# Altium project RF-lxSpark_1v0.PrjPcb (part 3 of 3)

## Sheet 15_BoardPowerSupply.SchDoc: Board power supply
size A3; Organization: Lime Microsystems; Address1: Surrey Tech Centre; Address2: Guildford GU2 7YG; Address3: Surrey; Address4: United Kingdom; Revision: SoDeRa-PCI v1.0; SheetNumber: 13; SheetTotal: 13
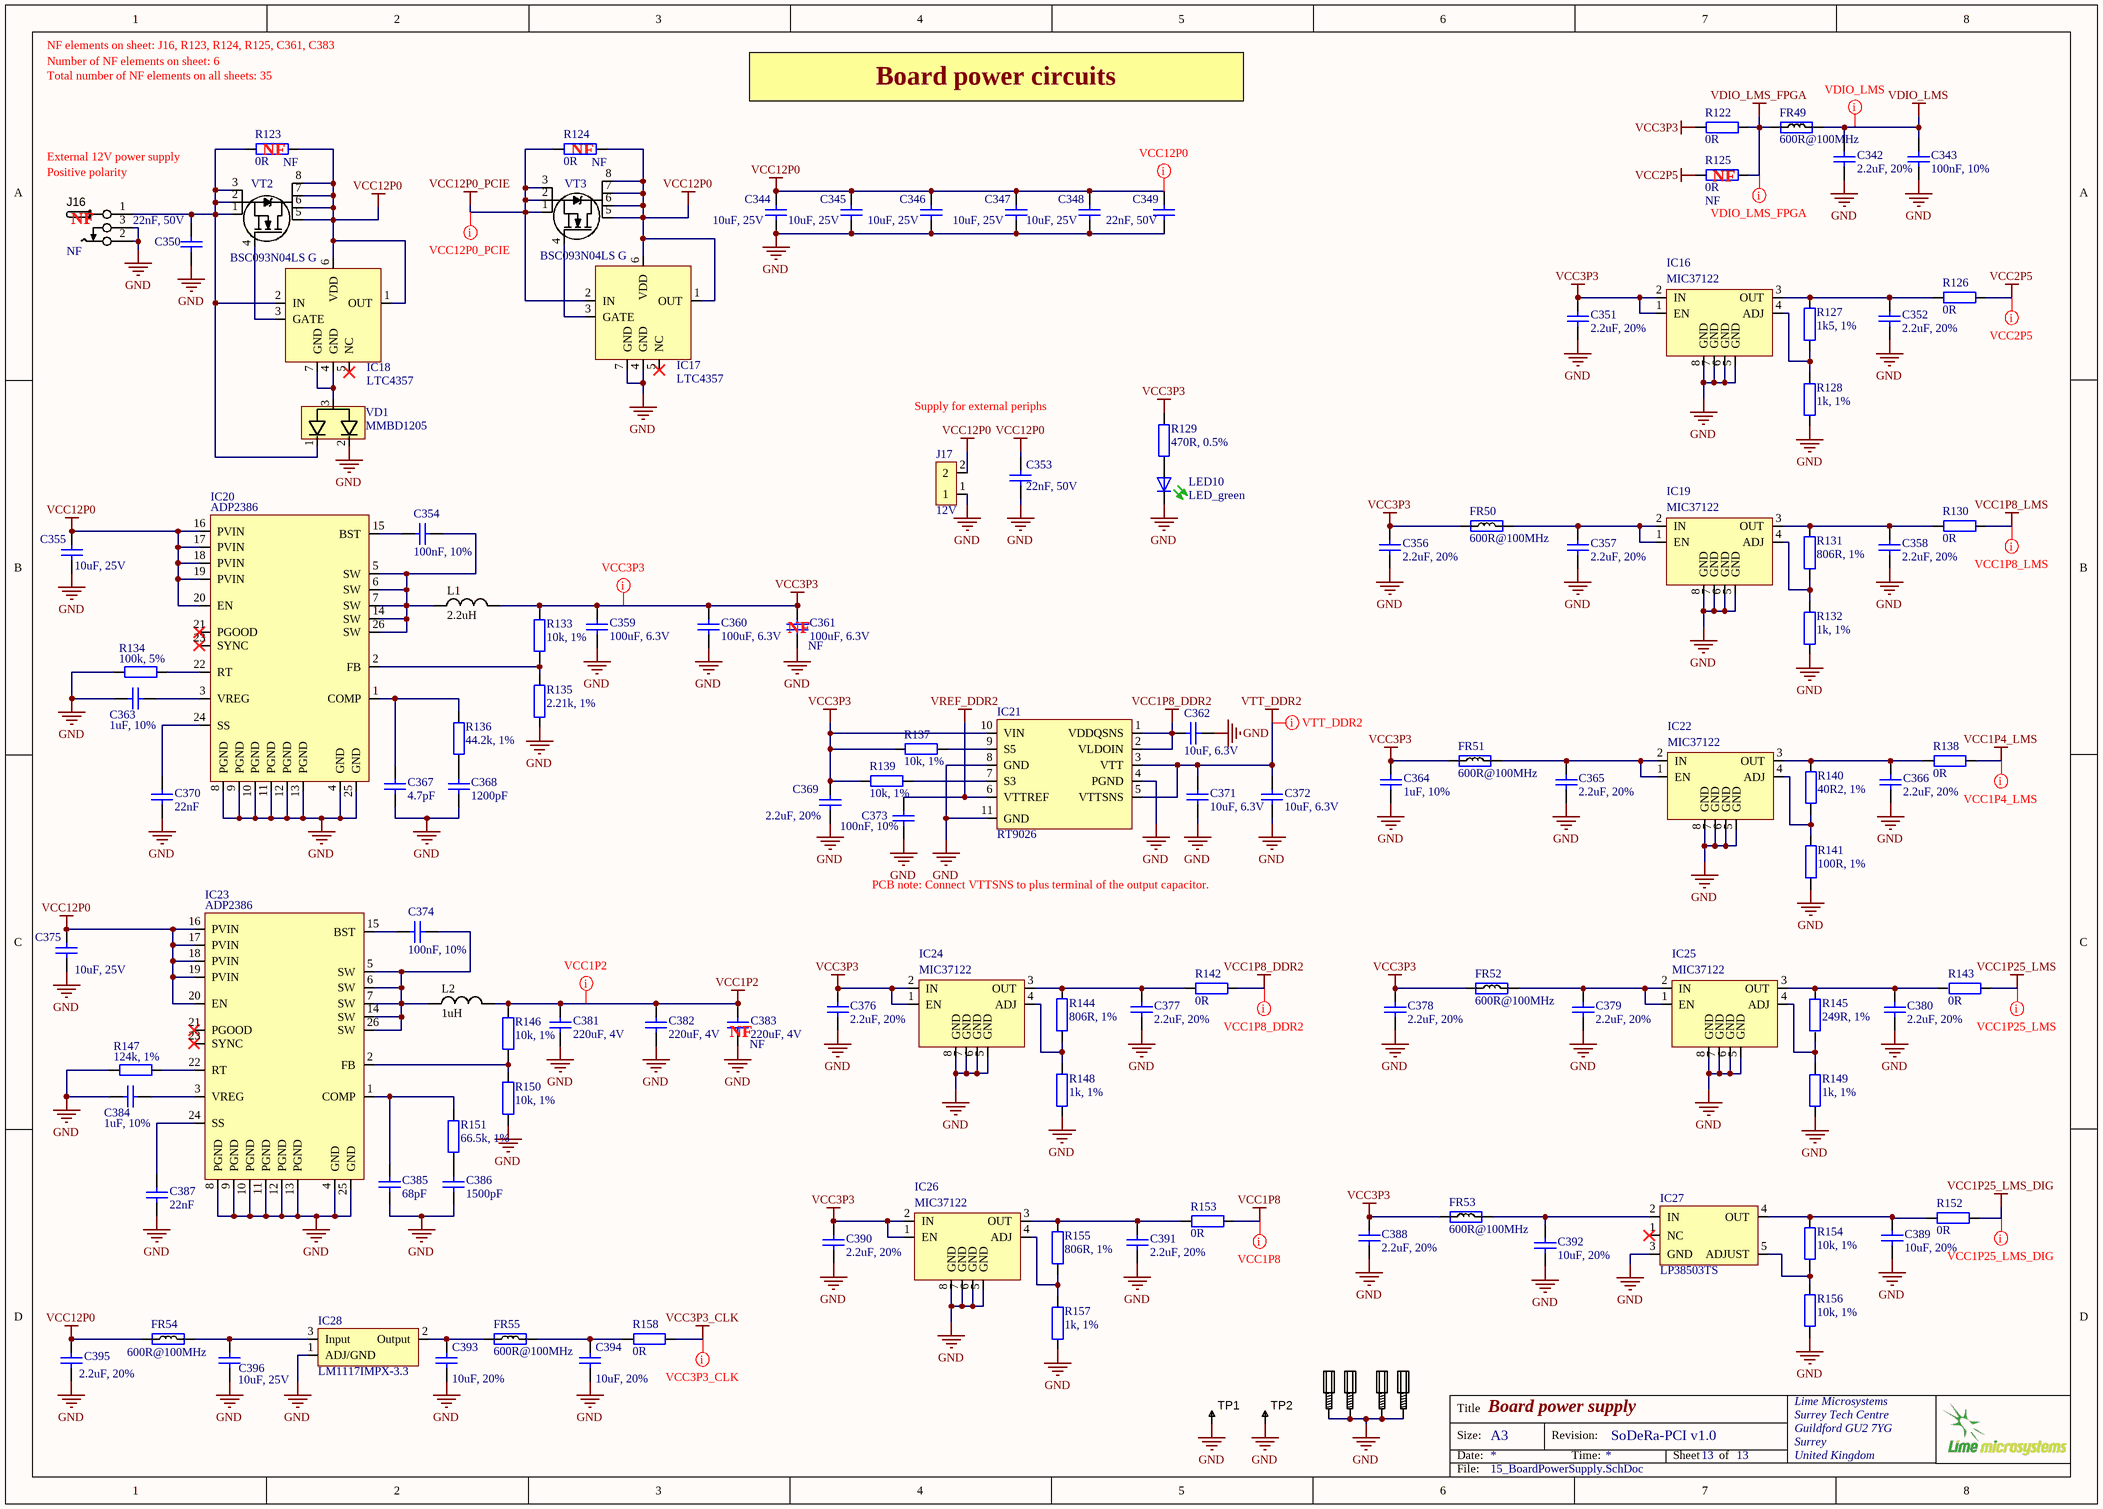
[diagram p8: 15_BoardPowerSupply.SchDoc]

### Parts
C342  2.2uF, 20%  [CAP0402]
C343  100nF, 10%  [CAP0402]
C344  10uF, 25V  [CAP0603]
C345  10uF, 25V  [CAP0603]
C346  10uF, 25V  [CAP0603]
C347  10uF, 25V  [CAP0603]
C348  10uF, 25V  [CAP0603]
C349  22nF, 50V  [CAP0402]
C350  22nF, 50V  [CAP0402]
C351  2.2uF, 20%  [CAP0402]
C352  2.2uF, 20%  [CAP0402]
C353  22nF, 50V  [CAP0402]
C354  100nF, 10%  [CAP0402]
C355  10uF, 25V  [CAP0603]
C356  2.2uF, 20%  [CAP0402]
C357  2.2uF, 20%  [CAP0402]
C358  2.2uF, 20%  [CAP0402]
C359  100uF, 6.3V  [CAP1206]
C360  100uF, 6.3V  [CAP1206]
C361  100uF, 6.3V  Assembly Info: NF  [CAP1206]
C362  10uF, 6.3V  [CAP0603]
C363  1uF, 10%  [CAP0402]
C364  1uF, 10%  [CAP0402]
C365  2.2uF, 20%  [CAP0402]
C366  2.2uF, 20%  [CAP0402]
C367  4.7pF  [CAP0402]
C368  1200pF  [CAP0402]
C369  2.2uF, 20%  [CAP0402]
C370  22nF  [CAP0402]
C371  10uF, 6.3V  [CAP0603]
C372  10uF, 6.3V  [CAP0603]
C373  100nF, 10%  [CAP0402]
C374  100nF, 10%  [CAP0402]
C375  10uF, 25V  [CAP0603]
C376  2.2uF, 20%  [CAP0402]
C377  2.2uF, 20%  [CAP0402]
C378  2.2uF, 20%  [CAP0402]
C379  2.2uF, 20%  [CAP0402]
C380  2.2uF, 20%  [CAP0402]
C381  220uF, 4V  [CAP1206]
C382  220uF, 4V  [CAP1206]
C383  220uF, 4V  Assembly Info: NF  [CAP1206]
C384  1uF, 10%  [CAP0402]
C385  68pF  [CAP0402]
C386  1500pF  [CAP0402]
C387  22nF  [CAP0402]
C388  2.2uF, 20%  [CAP0402]
C389  10uF, 20%  [CAP0603]
C390  2.2uF, 20%  [CAP0402]
C391  2.2uF, 20%  [CAP0402]
C392  10uF, 20%  [CAP0603]
C393  10uF, 20%  [CAP0603]
C394  10uF, 20%  [CAP0603]
C395  2.2uF, 20%  [CAP0402]
C396  10uF, 25V  [CAP0603]
FR49  600R@100MHz  [RES0805]
FR50  600R@100MHz  [RES0805]
FR51  600R@100MHz  [RES0805]
FR52  600R@100MHz  [RES0805]
FR53  600R@100MHz  [RES0805]
FR54  600R@100MHz  [RES0805]
FR55  600R@100MHz  [RES0805]
IC16  MIC37122  [MIC37122YM TR_SO8]
IC17  LTC4357  [LTC4357]
IC18  LTC4357  [LTC4357]
IC19  MIC37122  [MIC37122YM TR_SO8]
IC20  ADP2386  [ADP2386]
IC21  RT9026  [MSOP10]
IC22  MIC37122  [MIC37122YM TR_SO8]
IC23  ADP2386  [ADP2386]
IC24  MIC37122  [MIC37122YM TR_SO8]
IC25  MIC37122  [MIC37122YM TR_SO8]
IC26  MIC37122  [MIC37122YM TR_SO8]
IC27  LP38503TS  [TO-263-5_v2]
IC28  LM1117IMPX-3.3  [sot223]
J16  Assembly Info: NF  [CONN_PWR_JACK_v2]  (hidden comment: CONN_PWR_JACK_2.1x5.5mm)
J17  12V  [HDR_1x2]
L1  2.2uH  [FDVE1040_TOKO_INDUCTOR]
L2  1uH  [FDVE1040_TOKO_INDUCTOR]
LED10  LED_green  [LED-0603-GREEN]
MECH1  # pcs.  [PCB_standoff]  (value not drawn)
MECH2  # pcs.  [PCB_standoff]  (value not drawn)
MECH3  # pcs.  [PCB_standoff]  (value not drawn)
MECH4  # pcs.  [PCB_standoff]  (value not drawn)
R122  0R  [RES0402]
R123  0R  Assembly Info: NF  [RES0805]
R124  0R  Assembly Info: NF  [RES0805]
R125  0R  Assembly Info: NF  [RES0402]
R126  0R  [RES0402]
R127  1k5, 1%  [RES0402]
R128  1k, 1%  [RES0402]
R129  470R, 0.5%  [RES0402]
R130  0R  [RES0402]
R131  806R, 1%  [RES0402]
R132  1k, 1%  [RES0402]
R133  10k, 1%  [RES0402]
R134  100k, 5%  [RES0402]
R135  2.21k, 1%  [RES0402]
R136  44.2k, 1%  [RES0402]
R137  10k, 1%  [RES0402]
R138  0R  [RES0402]
R139  10k, 1%  [RES0402]
R140  40R2, 1%  [RES0402]
R141  100R, 1%  [RES0402]
R142  0R  [RES0402]
R143  0R  [RES0402]
R144  806R, 1%  [RES0402]
R145  249R, 1%  [RES0402]
R146  10k, 1%  [RES0402]
R147  124k, 1%  [RES0402]
R148  1k, 1%  [RES0402]
R149  1k, 1%  [RES0402]
R150  10k, 1%  [RES0402]
R151  66.5k, 1%  [RES0402]
R152  0R  [RES0402]
R153  0R  [RES0402]
R154  10k, 1%  [RES0402]
R155  806R, 1%  [RES0402]
R156  10k, 1%  [RES0402]
R157  1k, 1%  [RES0402]
R158  0R  [RES0402]
TP1  TESTPOINT_THT_MINI  [TP-THT-MIDI]  (value not drawn)
TP2  TESTPOINT_THT_MINI  [TP-THT-MIDI]  (value not drawn)
VD1  MMBD1205  [SOT23-3_v2]
VT2  BSC093N04LS G  [BSC093N04LS_G]
VT3  BSC093N04LS G  [BSC093N04LS_G]

### Nets
GND: C342.1 C343.2 C344.1 C345.1 C346.1 C347.1 C348.1 C349.2 C350.2 C351.1 C352.1 C353.2 C355.1 C356.1 C357.1 C358.1 C359.1 C360.1 C361.1 C362.1 C363.2 C364.1 C365.1 C366.1 C367.2 C368.2 C369.1 C370.2 C371.1 C372.1 C373.2 C375.1 C376.1 C377.1 C378.1 C379.1 C380.1 C381.1 C382.1 C383.1 C384.2 C385.2 C386.2 C387.2 C388.1 C389.1 C390.1 C391.1 C392.1 C393.1 C394.1 C395.1 C396.1 IC16.5(GND) IC16.6(GND) IC16.7(GND) IC16.8(GND) IC17.4(GND) IC17.7(GND) IC19.5(GND) IC19.6(GND) IC19.7(GND) IC19.8(GND) IC20.4(GND) IC20.8(PGND) IC20.9(PGND) IC20.10(PGND) IC20.11(PGND) IC20.12(PGND) IC20.13(PGND) IC20.25(GND) IC21.4(PGND) IC21.8(GND) IC21.11(GND) IC22.5(GND) IC22.6(GND) IC22.7(GND) IC22.8(GND) IC23.4(GND) IC23.8(PGND) IC23.9(PGND) IC23.10(PGND) IC23.11(PGND) IC23.12(PGND) IC23.13(PGND) IC23.25(GND) IC24.5(GND) IC24.6(GND) IC24.7(GND) IC24.8(GND) IC25.5(GND) IC25.6(GND) IC25.7(GND) IC25.8(GND) IC26.5(GND) IC26.6(GND) IC26.7(GND) IC26.8(GND) IC27.3(GND) IC28.1(ADJ/GND) J16.2 J16.3 J17.1 LED10.K(C) MECH1.MH1 MECH2.MH1 MECH3.MH1 MECH4.MH1 R128.1 R132.1 R134.2 R135.1 R141.2 R147.2 R148.1 R149.1 R150.2 R156.2 R157.1 TP1.1 TP2.1 VD1.2
VCC1P2: C381.2 C382.2 C383.2 L2.2 R146.1
VCC1P4_LMS: R138.1
VCC1P8: R153.1
VCC1P8_DDR2: C362.2 IC21.1(VDDQSNS) IC21.2(VLDOIN) R142.1
VCC1P8_LMS: R130.1
VCC1P25_LMS: R143.1
VCC1P25_LMS_DIG: R152.1
VCC2P5: R125.2 R126.1
VCC3P3: C351.2 C356.2 C359.2 C360.2 C361.2 C364.2 C369.2 C376.2 C378.2 C388.2 C390.2 FR50.1 FR51.1 FR52.1 FR53.1 IC16.1(EN) IC16.2(IN) IC21.10(VIN) IC24.1(EN) IC24.2(IN) IC26.1(EN) IC26.2(IN) L1.2 R122.2 R129.2 R133.1 R137.1 R139.1
VCC3P3_CLK: R158.1
VCC12P0: C344.2 C345.2 C346.2 C347.2 C348.2 C349.1 C353.1 C355.2 C375.2 C395.2 FR54.1 IC17.1(OUT) IC17.6(VDD) IC18.1(OUT) IC18.6(VDD) IC20.16(PVIN) IC20.17(PVIN) IC20.18(PVIN) IC20.19(PVIN) IC20.20(EN) IC23.16(PVIN) IC23.17(PVIN) IC23.18(PVIN) IC23.19(PVIN) IC23.20(EN) J17.2 R123.1 R124.1 VT2.5(D) VT2.6(D) VT2.7(D) VT2.8(D) VT3.5(D) VT3.6(D) VT3.7(D) VT3.8(D)
VCC12P0_PCIE: IC17.2(IN) R124.2 VT3.1(S) VT3.2(S) VT3.3(S)
VDIO_LMS: C342.2 C343.1 FR49.2
VDIO_LMS_FPGA: FR49.1 R122.1 R125.1
VREF_DDR2: C373.1 IC21.6(VTTREF)
VTT_DDR2: C371.2 C372.2 IC21.3(VTT) IC21.5(VTTSNS)
NetC350_1: C350.1 IC18.2(IN) J16.1 R123.2 VD1.1 VT2.1(S) VT2.2(S) VT2.3(S)
NetC352_2: C352.2 IC16.3(OUT) R126.2 R127.1
NetC354_1: C354.1 IC20.15(BST)
NetC354_2: C354.2 IC20.5(SW) IC20.6(SW) IC20.7(SW) IC20.14(SW) IC20.26(SW) L1.1
NetC357_2: C357.2 FR50.2 IC19.1(EN) IC19.2(IN)
NetC358_2: C358.2 IC19.3(OUT) R130.2 R131.1
NetC363_1: C363.1 IC20.3(VREG)
NetC365_2: C365.2 FR51.2 IC22.1(EN) IC22.2(IN)
NetC366_2: C366.2 IC22.3(OUT) R138.2 R140.1
NetC367_1: C367.1 IC20.1(COMP) R136.2
NetC368_1: C368.1 R136.1
NetC370_1: C370.1 IC20.24(SS)
NetC374_1: C374.1 IC23.15(BST)
NetC374_2: C374.2 IC23.5(SW) IC23.6(SW) IC23.7(SW) IC23.14(SW) IC23.26(SW) L2.1
NetC377_2: C377.2 IC24.3(OUT) R142.2 R144.1
NetC379_2: C379.2 FR52.2 IC25.1(EN) IC25.2(IN)
NetC380_2: C380.2 IC25.3(OUT) R143.2 R145.1
NetC384_1: C384.1 IC23.3(VREG)
NetC385_1: C385.1 IC23.1(COMP) R151.2
NetC386_1: C386.1 R151.1
NetC387_1: C387.1 IC23.24(SS)
NetC389_2: C389.2 IC27.4(OUT) R152.2 R154.1
NetC391_2: C391.2 IC26.3(OUT) R153.2 R155.1
NetC392_2: C392.2 FR53.2 IC27.2(IN)
NetC393_2: C393.2 FR55.1 IC28.2(Output)
NetC394_2: C394.2 FR55.2 R158.2
NetC396_2: C396.2 FR54.2 IC28.3(Input)
NetIC16_4: IC16.4(ADJ) R127.2 R128.2
NetIC17_3: IC17.3(GATE) VT3.4(G)
NetIC18_3: IC18.3(GATE) VT2.4(G)
NetIC18_4: IC18.4(GND) IC18.7(GND) VD1.3
NetIC19_4: IC19.4(ADJ) R131.2 R132.2
NetIC20_2: IC20.2(FB) R133.2 R135.2
NetIC20_22: IC20.22(RT) R134.1
NetIC21_7: IC21.7(S3) R139.2
NetIC21_9: IC21.9(S5) R137.2
NetIC22_4: IC22.4(ADJ) R140.2 R141.1
NetIC23_2: IC23.2(FB) R146.2 R150.1
NetIC23_22: IC23.22(RT) R147.1
NetIC24_4: IC24.4(ADJ) R144.2 R148.2
NetIC25_4: IC25.4(ADJ) R145.2 R149.2
NetIC26_4: IC26.4(ADJ) R155.2 R157.2
NetIC27_5: IC27.5(ADJUST) R154.2 R156.1
NetLED10_A: LED10.A R129.1

Not connected (* = marked no-connect by the designer): IC17 5(NC)*; IC18 5(NC)*; IC20 21(PGOOD)* 23(SYNC)*; IC23 21(PGOOD)* 23(SYNC)*; IC27 1(NC)*

### Layout directives
net class VDIO_LMS: VDIO_LMS
net class VDIO_LMS_FPGA: VDIO_LMS_FPGA
net class VCC2P5: VCC2P5
net class VCC1P8_LMS: VCC1P8_LMS
net class VCC1P4_LMS: VCC1P4_LMS
net class VCC1P25_LMS: VCC1P25_LMS
net class VCC1P25_LMS_DIG: VCC1P25_LMS_DIG
net class VCC1P8_DDR2: VCC1P8_DDR2
net class VCC1P8: VCC1P8
net class VCC3P3_CLK: VCC3P3_CLK
net class VCC1P2: VCC1P2
net class VCC3P3: VCC3P3
net class VTT_DDR2: VTT_DDR2
net class VCC12P0: VCC12P0
net class VCC12P0_PCIE: VCC12P0_PCIE

### Notes on the sheet
- Number of NF elements on sheet: 6
- Total number of NF elements on all sheets: 35
- NF elements on sheet: J16, R123, R124, R125, C361, C383
- Board power circuits
- (near J16) Positive polarity
- External 12V power supply
- (near R123) NF
- (near R124) NF
- (near R125) NF
- (near J16) NF
- Supply for external periphs
- (near C361) NF
- PCB note: Connect VTTSNS to plus terminal of the output capacitor.
- (near C383) NF
- Title
- Size:
- Date:
- A3
- Revision:
- Time:
- Sheet
- of
- File:

### Library data of the parts
C342 C351 C352 C356-C358 C365 C366 C369 C376-C380 C388 C390 C391 C395 = Cap_0402: Manufacturer Part Number 1: C1005X5R1C225K050BC; Manufacturer: TDK Corporation; Voltage - Rated: 16V; Temperature Coefficient: X5R; Capacitance: 2.2µF; Value: 2.2uF, 20%; Supplier 1: Digi-Key; Supplier Part Number 1: 445-9085-1-ND; Category: Capacitors; Thickness (Max): 0.022" (0.55mm); Applications: General Purpose; Package / Case: 0402 (1005 Metric); Size / Dimension: 0.039" L x 0.020" W (1.00mm x 0.50mm); Features: -; Mounting Type: Surface Mount, MLCC; Ratings: -; Lead Style: -; Operating Temperature: -55°C ~ 85°C; Lead Spacing: -; RoHS: RoHS Compliant; Height - Seated (Max): -; Tolerance: ±20%; Packaging: Tape & Reel (TR)
C343 C373 = Cap_0402: Manufacturer: Murata Electronics; Manufacturer Part Number: GRM155R71C104KA88D; Voltage Rating DC: 16 V; Type: General Purpose MLCC; Capacitance: 0.1 uF; Case Length: 1 mm; Dielectric: X7R; Case Height: 0.5 mm; Temperature Coefficient / Code: +/- 15 %; Value: 100nF, 10%; Supplier 1: Mouser; Supplier Part Number 1: 81-GRM155R71C104KA88; Case Code - in: 0402; RoHS: RoHS Compliant; Operating Temperature Range: - 55 C to + 125 C; Series: GRM; Termination Style: SMD/SMT; Tolerance: 10 %; Package / Case: 0402 (1005 metric); Maximum Operating Temperature: + 125 C; Case Code - mm: 1005; Minimum Operating Temperature: - 55 C; Product Category: Low & Medium Capacitance SMD Ceramic Chip Capacitors; Packaging: Reel; Product: General Type MLCCs; Category: Multilayer Ceramic Capacitors MLCC - SMD/SMT; Brand: Murata Electronics; Case Width: 0.5 mm; RoHS - Mouser: Y; Standard Pack Qty: 10000; Minimum Order Quantity: 1; Reeling: True; Manufacturer Part Number 1: GRM155R71C104KA88D
C344-C348 C355 C375 C396 = Cap_0603: Manufacturer: Murata Electronics North America; Manufacturer Part Number: GRM188R61E106MA73D; Capacitance: 10µF; Tolerance: ±20%; Temperature Coefficient: X5R; Supplier 1: Digi-Key; Supplier Part Number 1: 490-7202-2-ND; Category: Capacitors; RoHS: RoHS Compliant; Packaging: Tape & Reel (TR); Voltage - Rated: 25V; Mounting Type: Surface Mount, MLCC; Operating Temperature: -55°C ~ 85°C; Applications: General Purpose; Ratings: -; Package / Case: 0603 (1608 Metric); Size / Dimension: 0.063" L x 0.031" W (1.60mm x 0.80mm); Height - Seated (Max): -; Thickness (Max): 0.031" (0.80mm); Lead Spacing: -; Features: -; Lead Style: -; value: 10uF, 25V
C349 C350 C353 = Cap_0402: Manufacturer: Kemet; Manufacturer Part Number 1: C0402C223K5RACTU; Temperature Coefficient: X7R; Tolerance: ±10%; Capacitance: 0.022µF; Value: 22nF, 50V; Supplier 1: Digi-Key; Supplier Part Number 1: 399-7780-1-ND; Ratings: -; Packaging: Cut Tape (CT); Category: Capacitors; Size / Dimension: 0.039" L x 0.020" W (1.00mm x 0.50mm); RoHS: RoHS Compliant; Operating Temperature: -55°C ~ 125°C; Mounting Type: Surface Mount, MLCC; Applications: General Purpose; Voltage - Rated: 50V; Thickness (Max): 0.022" (0.55mm); Features: -; Height - Seated (Max): -; Lead Style: -; Package / Case: 0402 (1005 Metric); Lead Spacing: -
C354 C374 = Cap_0402: Manufacturer: Murata Electronics; Manufacturer Part Number 1: GRM155R71C104KA88D; Voltage Rating DC: 16 V; Type: General Purpose MLCC; Capacitance: 0.1 uF; Case Length: 1 mm; Dielectric: X7R; Case Height: 0.5 mm; Temperature Coefficient / Code: +/- 15 %; Value: 100nF, 10%; Supplier 1: Mouser; Supplier Part Number 1: 81-GRM155R71C104KA88; Case Code - in: 0402; RoHS: RoHS Compliant; Operating Temperature Range: - 55 C to + 125 C; Series: GRM; Termination Style: SMD/SMT; Tolerance: 10 %; Package / Case: 0402 (1005 metric); Maximum Operating Temperature: + 125 C; Case Code - mm: 1005; Minimum Operating Temperature: - 55 C; Product Category: Low & Medium Capacitance SMD Ceramic Chip Capacitors; Packaging: Reel; Product: General Type MLCCs; Category: Multilayer Ceramic Capacitors MLCC - SMD/SMT; Brand: Murata Electronics; Case Width: 0.5 mm; RoHS - Mouser: Y; Standard Pack Qty: 10000; Minimum Order Quantity: 1; Reeling: True; Manufacturer Part Number: GRM155R71C104KA88D
C359-C361 = Cap_1206: Manufacturer: MURATA; Manufacturer Part Number 1: GRM31CR60J107ME39L.; Capacitance Tolerance: ± 20%; Ceramic Capacitor Case: 1206 [3216 Metric]; Voltage Rating: 6.3; value: 100uF, 6.3V; Supplier Part Number 1: 1735535; Supplier 1: Farnell
C362 C371 C372 = Cap_0603: Manufacturer Part Number 1: CC0603MRX5R5BB106; Capacitance: 10µF; Tolerance: ±20%; Supplier 1: Digi-Key; Supplier Part Number 1: 311-1448-2-ND; Package / Case: 0603 (1608 Metric); Category: Capacitors; Voltage - Rated: 6.3V; Value: 10uF, 6.3V
C363 C364 C384 = Cap_0402: Manufacturer Part Number 1: GRM155R61A105KE15J; Manufacturer: TDK; Voltage Rating: 10; Product Range: TDK - C Series; Ceramic Capacitor Case: 0402 [1005 Metric]; Capacitance: 1; Dielectric Characteristic: X6; Value: 1uF, 10%; Supplier 1: Newark; Supplier Part Number 1: 490-6298-2-ND; Capacitance Tolerance: ± 10%; MSL: -; RoHS: YES
C367 = Cap_0402: Manufacturer: MURATA; Manufacturer Part Number 1: GRM1555C1H4R7CA01D; Capacitance Tolerance: ± 0.25; Voltage Rating: 50; Dielectric Characteristic: C0G / NP0; Ceramic Capacitor Case: 0402 [1005 Metric]; Capacitance: 4.7; SVHC: No SVHC (15-Jun-2015; Product Range: GRM Series; Value: 4.7pF; Supplier 1: Farnell; Supplier Part Number 1: 2434644; Operating Temperature Max: 125; Operating Temperature Min: -55; MSL: MSL 1 - Unlimited; RoHS: YES; Packaging: Cut Tape
C368 = Cap_0402: Manufacturer: Kemet; Manufacturer Part Number 1: C0402C122J5GACTU; Temperature Coefficient: C0G, NP0; Tolerance: ±5%; Voltage - Rated: 50V; Value: 1200pF; Supplier 1: Digi-Key; Supplier Part Number 1: 399-7334-1-ND; Thickness (Max): 0.022" (0.55mm); Capacitance: 1200pF; Lead Spacing: -; Mounting Type: Surface Mount, MLCC; Package / Case: 0402 (1005 Metric); Category: Capacitors; Size / Dimension: 0.039" L x 0.020" W (1.00mm x 0.50mm); Lead Style: -; Ratings: -; Features: -; Packaging: Cut Tape (CT); RoHS: RoHS Compliant; Operating Temperature: -55°C ~ 125°C; Applications: General Purpose; Height - Seated (Max): -
C370 C387 = Cap_0402: Manufacturer: Kemet; Manufacturer Part Number 1: C0402C223K5RACTU; Temperature Coefficient: X7R; Tolerance: ±10%; Voltage - Rated: 50V; Capacitance: 0.022µF; Value: 22nF; Supplier 1: Digi-Key; Supplier Part Number 1: 399-7780-1-ND; Ratings: -; Packaging: Cut Tape (CT); Category: Capacitors; Size / Dimension: 0.039" L x 0.020" W (1.00mm x 0.50mm); RoHS: RoHS Compliant; Operating Temperature: -55°C ~ 125°C; Mounting Type: Surface Mount, MLCC; Applications: General Purpose; Thickness (Max): 0.022" (0.55mm); Features: -; Height - Seated (Max): -; Lead Style: -; Package / Case: 0402 (1005 Metric); Lead Spacing: -
C381-C383 = Cap_1206: Manufacturer Part Number: GRM31CR60G227ME11L; Manufacturer: Murata Electronics North America; Capacitance: 220µF; Temperature Coefficient: X5R; Tolerance: ±20%; Package / Case: 1206 (3216 Metric); Supplier 1: Digi-Key; Packaging: Cut Tape (CT); Size / Dimension: 0.126" L x 0.063" W (3.20mm x 1.60mm); Operating Temperature: -55°C ~ 85°C; Voltage - Rated: 4V; Mounting Type: Surface Mount, MLCC; Ratings: -; Supplier Part Number 1: 490-9774-1-ND; Category: Capacitors; Lead Spacing: -; Lead Style: -; Applications: General Purpose; Features: -; Height - Seated (Max): -; Thickness (Max): 0.075" (1.90mm); RoHS: RoHS Compliant; Value: 220uF, 4V
C385 = Cap_0402: Manufacturer Part Number 1: CBR04C680F3GAC; Manufacturer: Kemet; Temperature Coefficient: C0G, NP0; Voltage - Rated: 25V; Tolerance: ±1%; Value: 68pF; Supplier 1: Digi-Key; Supplier Part Number 1: 399-11255-1-ND; Applications: RF, Microwave, High Frequency; Capacitance: 68pF; Mounting Type: Surface Mount, MLCC; Package / Case: 0402 (1005 Metric); Features: High Q, Low Loss; Lead Spacing: -; Size / Dimension: 0.039" L x 0.020" W (1.00mm x 0.50mm); Operating Temperature: -55°C ~ 125°C; Packaging: Cut Tape (CT); Thickness (Max): 0.022" (0.55mm); Category: Capacitors; Lead Style: -; Ratings: -; Height - Seated (Max): -; RoHS: RoHS Compliant
C386 = Cap_0402: Manufacturer Part Number 1: CL05B152KB5NNNC; Manufacturer: Samsung Electro-Mechanics America, Inc.; Temperature Coefficient: X7R; Voltage - Rated: 50V; Tolerance: ±10%; Value: 1500pF; Supplier 1: Digi-Key; Supplier Part Number 1: 1276-1521-1-ND; Thickness (Max): 0.022" (0.55mm); Features: -; Category: Capacitors; Size / Dimension: 0.039" L x 0.020" W (1.00mm x 0.50mm); RoHS: RoHS Compliant; Package / Case: 0402 (1005 Metric); Mounting Type: Surface Mount, MLCC; Packaging: Cut Tape (CT); Lead Style: -; Lead Spacing: -; Capacitance: 1500pF; Applications: General Purpose; Height - Seated (Max): -; Ratings: -; Operating Temperature: -55°C ~ 125°C
C389 C392-C394 = Cap_0603: Manufacturer: Yageo; Manufacturer Part Number 1: GRM188R61C106MA73D; Temperature Coefficient: X5R; Capacitance: 10µF; Voltage - Rated: 16V; Value: 10uF, 20%; Supplier 1: Digi-Key; Supplier Part Number 1: 490-7201-2-ND; Category: Capacitors; Ratings: -; Features: -; Lead Style: -; Package / Case: 0603 (1608 Metric); Lead Spacing: -; Applications: General Purpose; Operating Temperature: -55°C ~ 85°C; Tolerance: ±20%; Thickness (Max): 0.039" (1.00mm); Mounting Type: Surface Mount, MLCC; RoHS: RoHS Compliant; Size / Dimension: 0.063" L x 0.031" W (1.60mm x 0.80mm); Packaging: Tape & Reel (TR); Height - Seated (Max): -
FR49-FR55 = Ferrite: Manufacturer Part Number 1: MPZ2012S601AT000; Manufacturer: TDK Corporation; Filter Type: Differential Mode - Single; Impedance @ Frequency: 600 Ohm @ 100MHz; DC Resistance (DCR): 100 mOhm Max; Current Rating: 2A; Supplier 1: Digi-Key; Supplier Part Number 1: 445-2206-2-ND; Mounting Type: Surface Mount; RoHS: RoHS Compliant; Height (Max): 0.041" (1.05mm); Packaging: Tape & Reel (TR); Category: Filters; Package / Case: 0805 (2012 Metric); Size / Dimension: 0.079" L x 0.049" W (2.00mm x 1.25mm)
IC16 IC19 IC22 IC24-IC26 = MIC37122: Manufacturer Part Number 1: MIC37122YM TR; Voltage - Input: 2.375 V ~ 5.5 V; Supplier 1: Digi-Key; Supplier: Digi-Key; Package / Case: 8-SOIC (0.154", 3.90mm Width); Supplier Part Number 1: 576-4334-2-ND
IC17 IC18 = LTC4357: Manufacturer Part Number: LTC4357IDCB#TRMPBF; Current - Supply: 500µA; Delay Time - OFF: 300ns; Voltage - Supply: 9 V ~ 80 V; FET Type: N-Channel; Supplier 1: Digi-Key; Type: N+1 ORing Controller; Category: Integrated Circuits (ICs); Applications: Automotive, Redundant Power Supplies, Telecom Infrastructure; Operating Temperature: -40°C ~ 85°C; Supplier Device Package: 6-DFN (2x3); Supplier Part Number 1: LTC4357IDCB#TRMPBFDKR-ND
IC20 = ADP2386: Manufacturer Part Number: ADP2386ACPZN-R7; Manufacturer: Analog Devices Inc.; Function: Step-Down; Voltage - Output (Max): 18V; Synchronous Rectifier: Yes; Output Configuration: Positive; Frequency - Switching: 200kHz ~ 1.4MHz; Number of Outputs: 1; Output Type: Adjustable; Topology: Buck; Voltage - Input (Min): 4.5V; Voltage - Output (Min/Fixed): 0.6V; Voltage - Input (Max): 20V; Current - Output: 6A; Supplier 1: Digi-Key; Packaging: Digi-Reel®; RoHS: RoHS Compliant; Package / Case: 24-WFQFN Exposed Pad, CSP; Operating Temperature: -40°C ~ 125°C (TJ); Supplier Device Package 1: 24-LFCSP-WQ (4x4); Mounting Type: Surface Mount; Category: Integrated Circuits (ICs); Supplier Part Number 1: ADP2386ACPZN-R7DKR-ND
IC21 = RT9026: Manufacturer Part Number 1: RT9026GFP; Manufacturer: Richtek USA Inc.; Number of Outputs: 1; Voltage - Input: 3.15 V ~ 5.5 V; Supplier 1: Digi-Key; Supplier Part Number 1: 1028-1010-1-ND; Supplier Device Package: 10-MSOP-EP; Operating Temperature: -40°C ~ 85°C; Applications: Converter, DDR Bus Termination Regulator; RoHS: RoHS Compliant; Packaging: Cut Tape (CT); Mounting Type: Surface Mount; Package / Case: 10-TFSOP, 10-MSOP (0.118", 3.00mm Width) Exposed Pad; Category: Integrated Circuits (ICs)
IC23 = ADP2386: Manufacturer Part Number 1: ADP2386ACPZN-R7; Manufacturer: Analog Devices Inc.; Function: Step-Down; Voltage - Output (Max): 18V; Synchronous Rectifier: Yes; Output Configuration: Positive; Frequency - Switching: 200kHz ~ 1.4MHz; Number of Outputs: 1; Output Type: Adjustable; Topology: Buck; Voltage - Input (Min): 4.5V; Voltage - Output (Min/Fixed): 0.6V; Voltage - Input (Max): 20V; Current - Output: 6A; Supplier 1: Digi-Key; Packaging: Digi-Reel®; RoHS: RoHS Compliant; Package / Case: 24-WFQFN Exposed Pad, CSP; Operating Temperature: -40°C ~ 125°C (TJ); Supplier Device Package: 24-LFCSP-WQ (4x4); Mounting Type: Surface Mount; Category: Integrated Circuits (ICs); Supplier Part Number 1: ADP2386ACPZN-R7DKR-ND
IC27 = LP38503TS: Manufacturer Part Number: LP38503TS-ADJ/NOPB; Manufacturer: Texas Instruments; Regulator Topology: Positive Adjustable; Voltage - Dropout (Typical): 0.42V @ 3A; Number of Regulators: 1; Current - Output: 3A; Voltage - Output: 0.6 V ~ 5 V; Voltage - Input: 2.7 V ~ 5.5 V; Supplier 1: Digi-Key; Category: Integrated Circuits (ICs); RoHS: RoHS Compliant By Exemption; Operating Temperature: -40°C ~ 125°C; Packaging: Tube; Current - Limit (Min): -; Package / Case: TO-263-6, D²Pak (5 Leads + Tab), TO-263BA; Mounting Type: Surface Mount; Supplier Device Package: DDPAK/TO-263-5; Supplier Part Number 1: LP38503TS-ADJ/NOPB-ND
IC28 = LM1117IMPX-3.3: Manufacturer Part Number 1: LM1117IMP-3.3/NOPB; Manufacturer: Texas Instruments; Regulator Topology: Positive Fixed; Voltage - Input: Up to 15V; Current - Limit (Min): 800mA; Number of Regulators: 1; Voltage - Output: 3.3V; Voltage - Dropout (Typical): 1.2V @ 800mA; Supplier 1: Digi-Key; RoHS: RoHS Compliant; Mounting Type: Surface Mount; Operating Temperature: -40°C ~ 125°C; Supplier Device Package: SOT-223; Packaging: Cut Tape (CT); Package / Case: TO-261-4, TO-261AA; Current - Output: 800mA; Category: Integrated Circuits (ICs); Supplier Part Number 1: LM1117IMP-3.3/NOPBCT-ND
J16 = CONN_PWR_JACK_2.1x5.5mm: Power Connector, THT, 2.1mm ID, 5.5mm OD; Manufacturer Part Number 1: RAPC712X; Manufacturer: SWITCHCRAFT; Contact Termination Type: Solder; Connector Mounting: PCB; Current Rating: 5; Gender: Receptacle; Voltage Rating V AC: 250; Supplier 1: Farnell; Supplier Part Number 1: 1608726; Mounting Type: PCB Through Hole; Contact Termination: Solder
J17 = Jumper: Manufacturer Part Number 1: 961102-6404-AR; Connector Type: Header, Unshrouded; Supplier 1: Digi-Key; Supplier Part Number 1: 3M9447-ND; Contact Type: Male Pin; Color: Black; Mounting Type: Through Hole; Category: Connectors, Interconnects; Contact Finish: Gold
L1 = Inductor_0603: Manufacturer Part Number 1: IHLP4040DZER2R2M01; Manufacturer: Vishay Dale; Inductance: 2.2µH; Type: Molded; Current Rating: 12A; Frequency - Test: 100kHz; Current - Saturation: 25.6A; DC Resistance (DCR): 9 mOhm Max; Shielding: Shielded; Tolerance: ±20%; Supplier 1: Digi-Key; Supplier Part Number 1: 541-1299-1-ND; Package / Case: Nonstandard; Material - Core: -; Size / Dimension: 0.430" L x 0.405" W (10.92mm x 10.30mm); Supplier Device Package: -; Frequency - Self Resonant: -; Packaging: Cut Tape (CT); Height - Seated (Max): 0.158" (4.00mm); Category: Inductors, Coils, Chokes; RoHS: RoHS Compliant; Mounting Type: Surface Mount; Operating Temperature: -55°C ~ 125°C; Q @ Freq: -; value: 2.2uH
L2 = Inductor_0603: Manufacturer: Vishay Dale; Manufacturer Part Number 1: IHLP3232DZER1R0M01; Tolerance: ±20%; Frequency - Test: 100kHz; DC Resistance (DCR): 5.78 mOhm Max; Inductance: 1µH; Frequency - Self Resonant: 42MHz; Shielding: Shielded; Current - Saturation: 24A; Current Rating: 18A; Type: Molded; value: 1uH; Supplier 1: Digi-Key; Supplier Part Number 1: 541-1371-6-ND; Supplier Device Package: -; Packaging: Digi-Reel®; Height - Seated (Max): 0.158" (4.00mm); RoHS: RoHS Compliant; Size / Dimension: 0.340" L x 0.322" W (8.64mm x 8.18mm); Category: Inductors, Coils, Chokes; Mounting Type: Surface Mount; Material - Core: -; Package / Case: Nonstandard; Q @ Freq: -; Operating Temperature: -55°C ~ 125°C
LED10 = LED_green: Current - Test: 20mA; Voltage - Forward (Vf) (Typ): 2.2V; Color: Green; Supplier 1: Digi-Key; Supplier Part Number 1: 516-1425-2-ND; Category: Optoelectronics; Package / Case: 0603 (1608 Metric)
MECH1-MECH4 = STANDOFF_M-F_THREADED_M3x8x10mm_HEX_5mm dia: STANDOFF M/F MET 5MM HEX 10MM L; Manufacturer 1: Keystone Electronics; Manufacturer Part Number 1: 24313; Thread/Screw/Hole Size: M3 Thread; Plating: Nickel; Between Board Height: 0.394" (10.0mm); SCDType: undef; RoHS: RoHS Compliant; Description 1: STANDOFF M/F MET 5MM HEX 10MM L; Category: Hardware Fasteners Accessories; Stock 1: 240; Pricing 1: 10=0.969, 100=0.881, 500=0.58, 1000=0.3685, 2500=0.34215 (USD); Type: Hex Threaded, Male/Female; Size: 0.197" (5.0mm) Hex; Length - Overall: 0.709" (18.0mm); Material: Brass; Color: Natural; ComponentLink1URL: http://www.keyelco.com/pdfs/M55p67.pdf; ComponentLink1Description: http://www.keyelco.com/pdfs/M55p67.pdf; Supplier 1: Digi-Key; Supplier Part Number 1: 24313K-ND
R122 R125 R126 R130 R138 R142 R143 R152 R153 R158 = Res_0402: Manufacturer Part Number 1: RC0402JR-070RL; Manufacturer: Yageo; Resistance (Ohms): 0.0; Tolerance: Jumper; Power (Watts): 0.063W, 1/16W; Value: 0R; Supplier 1: Digi-Key; Supplier Part Number 1: 311-0.0JRTR-ND; Category: Resistors; Temperature Coefficient: -; Features: Moisture Resistant; Supplier Device Package: 0402; Height: 0.016" (0.40mm); Package / Case: 0402 (1005 Metric); Operating Temperature: -55°C ~ 155°C; Size / Dimension: 0.039" L x 0.020" W (1.00mm x 0.50mm); Composition: Thick Film; Packaging: Tape & Reel (TR); Number of Terminations: 2; RoHS: RoHS Compliant
R123 R124 = Res_0402: Manufacturer Part Number 1: CRCW08050000Z0EA; Manufacturer: Vishay Dale; Power (Watts): 0.125W, 1/8W; Resistance (Ohms): 0.0; Tolerance: Jumper; Value: 0R; Supplier 1: Digi-Key; Supplier Part Number 1: 541-0.0ATR-ND; Package / Case: 0805 (2012 Metric); Height: 0.020" (0.50mm); Packaging: Tape & Reel (TR); Operating Temperature: -55°C ~ 155°C; Temperature Coefficient: -; RoHS: RoHS Compliant; Size / Dimension: 0.079" L x 0.049" W (2.00mm x 1.25mm); Supplier Device Package: 0805 (2012 Metric); Number of Terminations: 2; Category: Resistors; Features: Automotive AEC-Q200; Composition: Thick Film
R127 = Res_0402: Manufacturer: Yageo; Manufacturer Part Number 1: RC0402FR-071K5L; Resistance (Ohms): 1.5k; Power (Watts): 0.063W, 1/16W; Temperature Coefficient: ±100ppm/°C; Value: 1k5, 1%; Supplier 1: Digi-Key; Supplier Part Number 1: 311-1.50KLRTR-ND; Category: Resistors; RoHS: RoHS Compliant; Packaging: Tape & Reel (TR); Tolerance: ±1%; Composition: Thick Film; Features: Moisture Resistant; Operating Temperature: -55°C ~ 155°C; Package / Case: 0402 (1005 Metric); Supplier Device Package: 0402; Size / Dimension: 0.039" L x 0.020" W (1.00mm x 0.50mm); Height: 0.016" (0.40mm); Number of Terminations: 2
R128 R132 R148 R149 R157 = Res_0402: Manufacturer: Stackpole Electronics Inc; Manufacturer Part Number 1: RMCF0402FT1K00; Temperature Coefficient: ±100ppm/°C; Power (Watts): 0.063W, 1/16W; Value: 1k, 1%; Supplier 1: Digi-Key; Supplier Part Number 1: RMCF0402FT1K00TR-ND; Resistance (Ohms): 1k; Packaging: Tape & Reel (TR); Category: Resistors; RoHS: RoHS Compliant; Tolerance: ±1%; Height: 0.016" (0.40mm); Number of Terminations: 2; Package / Case: 0402 (1005 Metric); Operating Temperature: -55°C ~ 155°C; Features: -; Composition: Thick Film; Supplier Device Package: 0402; Size / Dimension: 0.039" L x 0.020" W (1.00mm x 0.50mm)
R129 = Res_0402: Temperature Coefficient: ±25ppm/°C; Supplier 1: Digi-Key; Supplier Part Number 1: P470DETR-ND; Category: Resistors; Number of Terminations: 2; Composition: Thin Film; Tolerance: ±0.5%; value: 470R, 0.5%
R131 R144 R155 = Res_0402: Manufacturer Part Number 1: RMCF0402FT806R; Manufacturer: Stackpole Electronics Inc; Resistance (Ohms): 806; Power (Watts): 0.063W, 1/16W; Temperature Coefficient: ±100ppm/°C; Value: 806R, 1%; Supplier 1: Digi-Key; Supplier Part Number 1: RMCF0402FT806RCT-ND; Category: Resistors; Size / Dimension: 0.039" L x 0.020" W (1.00mm x 0.50mm); Tolerance: ±1%; Features: -; Number of Terminations: 2; RoHS: RoHS Compliant; Operating Temperature: -55°C ~ 155°C; Packaging: Cut Tape (CT); Package / Case: 0402 (1005 Metric); Composition: Thick Film; Height: 0.016" (0.40mm); Supplier Device Package: 0402
R133 R137 R139 R146 R150 R154 R156 = Res_0402: Manufacturer: Yageo; Manufacturer Part Number 1: RC0402FR-0710KL; Temperature Coefficient: ±100ppm/°C; Power (Watts): 0.063W, 1/16W; Value: 10k, 1%; Supplier 1: Digi-Key; Supplier Part Number 1: 311-10.0KLRTR-ND; Resistance (Ohms): 10k; Packaging: Tape & Reel (TR); RoHS: RoHS Compliant; Package / Case: 0402 (1005 Metric); Tolerance: ±1%; Operating Temperature: -55°C ~ 155°C; Size / Dimension: 0.039" L x 0.020" W (1.00mm x 0.50mm); Number of Terminations: 2; Category: Resistors; Height: 0.016" (0.40mm); Supplier Device Package: 0402; Features: Moisture Resistant; Composition: Thick Film
R134 = Res_0402: Manufacturer: Panasonic Electronic Components; Manufacturer Part Number: ERJ-2GEJ104X; Power (Watts): 0.1W, 1/10W; Temperature Coefficient: ±200ppm/°C; Value: 100k, 5%; Supplier 1: Digi-Key; Supplier Part Number 1: P100KJTR-ND; Category: Resistors; Size / Dimension: 0.039" L x 0.020" W (1.00mm x 0.50mm); Supplier Device Package: 0402; Composition: Thick Film; Number of Terminations: 2; RoHS: RoHS Compliant; Height: 0.016" (0.40mm); Operating Temperature: -55°C ~ 155°C; Features: Automotive AEC-Q200; Tolerance: ±5%; Packaging: Tape & Reel (TR); Resistance (Ohms): 100k; Package / Case: 0402 (1005 Metric)
R135 = Res_0402: Manufacturer: Stackpole Electronics Inc.; Manufacturer Part Number 1: RMCF0402FT2K21; Power (Watts): 0.063W, 1/16W; Temperature Coefficient: ±100ppm/°C; Value: 2.21k, 1%; Supplier 1: Digi-Key; Supplier Part Number 1: RMCF0402FT2K21CT-ND; Operating Temperature: -55°C ~ 155°C; Height: 0.016" (0.40mm); Tolerance: ±1%; Resistance (Ohms): 2.21k; Features: Automotive AEC-Q200; Package / Case: 0402 (1005 Metric); Packaging: Cut Tape (CT); Composition: Thick Film; Category: Resistors; Supplier Device Package: 0402; Number of Terminations: 2; RoHS: RoHS Compliant; Size / Dimension: 0.039" L x 0.020" W (1.00mm x 0.50mm)
R136 = Res_0402: Manufacturer Part Number 1: ERJ-2RKF4422X; Manufacturer: Panasonic Electronic Components; Power (Watts): 0.1W, 1/10W; Temperature Coefficient: ±100ppm/°C; Value: 44.2k, 1%; Supplier 1: Digi-Key; Supplier Part Number 1: P44.2KLCT-ND; Tolerance: ±1%; Supplier Device Package: 0402; Packaging: Cut Tape (CT); Size / Dimension: 0.039" L x 0.020" W (1.00mm x 0.50mm); Features: Automotive AEC-Q200; Package / Case: 0402 (1005 Metric); Height: 0.016" (0.40mm); Operating Temperature: -55°C ~ 155°C; Number of Terminations: 2; Composition: Thick Film; Resistance (Ohms): 44.2k; RoHS: RoHS Compliant; Category: Resistors
R140 = Res_0402: Manufacturer: Stackpole Electronics Inc; Manufacturer Part Number 1: RMCF0402FT40R2; Power (Watts): 0.063W, 1/16W; Resistance (Ohms): 40.2; Temperature Coefficient: ±100ppm/°C; Value: 40R2, 1%; Supplier 1: Digi-Key; Supplier Part Number 1: RMCF0402FT40R2CT-ND; Category: Resistors; Features: -; Packaging: Cut Tape (CT); Supplier Device Package: 0402; Operating Temperature: -55°C ~ 155°C; Tolerance: ±1%; RoHS: RoHS Compliant; Composition: Thick Film; Size / Dimension: 0.039" L x 0.020" W (1.00mm x 0.50mm); Package / Case: 0402 (1005 Metric); Height: 0.016" (0.40mm); Number of Terminations: 2
R141 = Res_0402: Manufacturer Part Number 1: RMCF0402FT100R; Manufacturer: Stackpole Electronics Inc; Power (Watts): 0.063W, 1/16W; Temperature Coefficient: ±100ppm/°C; Resistance (Ohms): 100; Value: 100R, 1%; Supplier 1: Digi-Key; Supplier Part Number 1: RMCF0402FT100RDKR-ND; Packaging: Digi-Reel®; Composition: Thick Film; Number of Terminations: 2; Package / Case: 0402 (1005 Metric); RoHS: RoHS Compliant; Category: Resistors; Size / Dimension: 0.039" L x 0.020" W (1.00mm x 0.50mm); Tolerance: ±1%; Supplier Device Package: 0402; Features: -; Height: 0.016" (0.40mm); Operating Temperature: -55°C ~ 155°C
R145 = Res_0402: Manufacturer Part Number 1: RMCF0402FT249R; Manufacturer: Stackpole Electronics Inc; Resistance (Ohms): 249; Power (Watts): 0.063W, 1/16W; Temperature Coefficient: ±100ppm/°C; Value: 249R, 1%; Supplier 1: Digi-Key; Supplier Part Number 1: RMCF0402FT249RCT-ND; Package / Case: 0402 (1005 Metric); Features: -; Size / Dimension: 0.039" L x 0.020" W (1.00mm x 0.50mm); Category: Resistors; Operating Temperature: -55°C ~ 155°C; Packaging: Cut Tape (CT); Tolerance: ±1%; Supplier Device Package: 0402; RoHS: RoHS Compliant; Composition: Thick Film; Number of Terminations: 2; Height: 0.016" (0.40mm)
R147 = Res_0402: Manufacturer: Panasonic Electronic Components; Manufacturer Part Number 1: ERJ-2RKF1243X; Power (Watts): 0.1W, 1/10W; Temperature Coefficient: ±100ppm/°C; Value: 124k, 1%; Supplier 1: Digi-Key; Supplier Part Number 1: P124KLCT-ND; Category: Resistors; Package / Case: 0402 (1005 Metric); Operating Temperature: -55°C ~ 155°C; Tolerance: ±1%; Packaging: Cut Tape (CT); Resistance (Ohms): 124k; Features: Automotive AEC-Q200; Height: 0.016" (0.40mm); Number of Terminations: 2; Supplier Device Package: 0402; Size / Dimension: 0.039" L x 0.020" W (1.00mm x 0.50mm); RoHS: RoHS Compliant; Composition: Thick Film
R151 = Res_0402: Manufacturer Part Number 1: ERJ-2RKF6652X; Manufacturer: Panasonic Electronic Components; Temperature Coefficient: ±100ppm/°C; Power (Watts): 0.1W, 1/10W; Value: 66.5k, 1%; Supplier 1: Digi-Key; Supplier Part Number 1: P66.5KLDKR-ND; Packaging: Digi-Reel®; Operating Temperature: -55°C ~ 155°C; Height: 0.016" (0.40mm); Size / Dimension: 0.039" L x 0.020" W (1.00mm x 0.50mm); Number of Terminations: 2; Package / Case: 0402 (1005 Metric); Resistance (Ohms): 66.5k; Category: Resistors; Supplier Device Package: 0402; Features: Automotive AEC-Q200; Composition: Thick Film; RoHS: RoHS Compliant; Tolerance: ±1%
TP1 TP2 = TESTPOINT_THT_MINI: Test Point PCB mount Miniature White; Manufacturer: Keystone Electronics; Manufacturer Part Number 1: 5011; Supplier 1: Digi-Key; Supplier Part Number 1: 5011K-ND; Category: Test and Measurement; Mounting Type: 0.063" (1.60mm) Hole Diameter; Material: Base, Nylon 46, UL 94V-0; Color: Black; Terminal: 0.015" x 0.032" (0.38mm x 0.81mm) Phosphor Bronze Wire, Silver Plated; Type: PC Test Point, Multipurpose; Packaging: Bulk; RoHS: RoHS Compliant
VD1 = MMBD1205: Reverse Recovery Time (trr): 4ns; Diode Configuration: 1 Pair Common Anode; Voltage - DC Reverse (Vr) (Max): 100V; Current - Average Rectified (Io) (per Diode): 200mA; Current - Reverse Leakage @ Vr: 50nA @ 50V; Voltage - Forward (Vf) (Max) @ If: 1V @ 200mA; Supplier 1: Digi-Key; Category: Discrete Semiconductor Products; Supplier Device Package: SOT-23-3 (TO-236); Package / Case: TO-236-3, SC-59, SOT-23-3; Supplier Part Number 1: MMBD1205CT-ND
VT2 VT3 = BSC093N04LS_G: Manufacturer: Infineon Technologies; Power - Max: 35W; Vgs(th) (Max) @ Id: 2V @ 14µA; Current - Continuous Drain (Id) @ 25°C: 13A (Ta), 49A (Tc); FET Type: MOSFET N-Channel, Metal Oxide; Rds On (Max) @ Id, Vgs: 9.3 mOhm @ 40A, 10V; Gate Charge (Qg) @ Vgs: 24nC @ 10V; Input Capacitance (Ciss) @ Vds: 1900pF @ 20V; Drain to Source Voltage (Vdss): 40V; Supplier 1: Digi-Key; Category: Discrete Semiconductor Products; Manufacturer Part Number: BSC093N04LS G; Package / Case: 8-PowerTDFN; Supplier Part Number 1: BSC093N04LS GDKR-ND

## Nets that join several sheets
GND: 04_LMS7002M_Digital (13 pins), 07_FPGA_banks_3_4_5 (11 pins), 08_FPGA_banks_6_7_8 (11 pins), 09_FPGA_misc (13 pins), 11_DDR2 (103 pins), 12_Periphs (49 pins), 13_Clocks_1 (70 pins), 15_BoardPowerSupply (122 pins)
VCC1P8: 07_FPGA_banks_3_4_5 (R36.2 R38.2), 15_BoardPowerSupply (R153.1)
VCC1P8_DDR2: 11_DDR2 (73 pins), 15_BoardPowerSupply (C362.2 IC21.1 IC21.2 R142.1)
VCC1P8_LMS: 13_Clocks_1 (FR42.1), 15_BoardPowerSupply (R130.1)
VCC3P3: 08_FPGA_banks_6_7_8 (R40.2), 09_FPGA_misc (9 pins), 12_Periphs (16 pins), 15_BoardPowerSupply (28 pins)
VCC3P3_CLK: 13_Clocks_1 (18 pins), 15_BoardPowerSupply (R158.1)
VCC12P0: 12_Periphs (C282.1 J14.2), 15_BoardPowerSupply (36 pins)
VCC12P0_PCIE: 12_Periphs (10 pins), 15_BoardPowerSupply (5 pins)
VDIO_LMS: 04_LMS7002M_Digital (14 pins), 15_BoardPowerSupply (C342.2 C343.1 FR49.2)
VDIO_LMS_FPGA: 13_Clocks_1 (C328.1 C329.1 IC15.10 IC15.11), 15_BoardPowerSupply (FR49.1 R122.1 R125.1)
VREF_DDR2: 07_FPGA_banks_3_4_5 (18 pins), 11_DDR2 (C254.1 C279.1 IC7.J2 IC8.J2), 15_BoardPowerSupply (C373.1 IC21.6)
VTT_DDR2: 11_DDR2 (72 pins), 15_BoardPowerSupply (C371.2 C372.2 IC21.3 IC21.5)
ADF_MUXOUT: 08_FPGA_banks_6_7_8 (IC4.F18), 13_Clocks_1 (IC14.15 R116.2)
DDR2_1_A0: 07_FPGA_banks_3_4_5 (IC4.W20), 11_DDR2 (IC7.M8 R64.5)
DDR2_1_A1: 07_FPGA_banks_3_4_5 (IC4.AA19), 11_DDR2 (IC7.M3 R62.5)
DDR2_1_A2: 07_FPGA_banks_3_4_5 (IC4.AA21), 11_DDR2 (IC7.M7 R62.2)
DDR2_1_A3: 07_FPGA_banks_3_4_5 (IC4.AB19), 11_DDR2 (IC7.N2 R65.3)
DDR2_1_A4: 07_FPGA_banks_3_4_5 (IC4.V21), 11_DDR2 (IC7.N8 R64.6)
DDR2_1_A5: 07_FPGA_banks_3_4_5 (IC4.AB20), 11_DDR2 (IC7.N3 R62.6)
DDR2_1_A6: 07_FPGA_banks_3_4_5 (IC4.W22), 11_DDR2 (IC7.N7 R62.1)
DDR2_1_A7: 07_FPGA_banks_3_4_5 (IC4.AA20), 11_DDR2 (IC7.P2 R65.2)
DDR2_1_A8: 07_FPGA_banks_3_4_5 (IC4.V22), 11_DDR2 (IC7.P8 R64.7)
DDR2_1_A9: 07_FPGA_banks_3_4_5 (IC4.AB21), 11_DDR2 (IC7.P3 R62.7)
DDR2_1_A10: 07_FPGA_banks_3_4_5 (IC4.AB17), 11_DDR2 (IC7.M2 R65.4)
DDR2_1_A11: 07_FPGA_banks_3_4_5 (IC4.U22), 11_DDR2 (IC7.P7 R64.8)
DDR2_1_A12: 07_FPGA_banks_3_4_5 (IC4.Y22), 11_DDR2 (IC7.R2 R62.8)
DDR2_1_BA0: 07_FPGA_banks_3_4_5 (IC4.T20), 11_DDR2 (IC7.L2 R65.5)
DDR2_1_BA1: 07_FPGA_banks_3_4_5 (IC4.R20), 11_DDR2 (IC7.L3 R65.7)
DDR2_1_BA2: 07_FPGA_banks_3_4_5 (IC4.U20), 11_DDR2 (IC7.L1 R65.6)
DDR2_1_CASn: 07_FPGA_banks_3_4_5 (IC4.P22), 11_DDR2 (IC7.L7 R62.3)
DDR2_1_CK_N: 07_FPGA_banks_3_4_5 (IC4.T9), 11_DDR2 (IC7.K8 R63.2)
DDR2_1_CK_P: 07_FPGA_banks_3_4_5 (IC4.R9), 11_DDR2 (IC7.J8 R63.1)
DDR2_1_CKE: 07_FPGA_banks_3_4_5 (IC4.T19), 11_DDR2 (IC7.K2 R65.8)
DDR2_1_CSn: 07_FPGA_banks_3_4_5 (IC4.T22), 11_DDR2 (IC7.L8 R64.4)
DDR2_1_DM0: 07_FPGA_banks_3_4_5 (IC4.R13), 11_DDR2 (IC7.F3)
DDR2_1_DM1: 07_FPGA_banks_3_4_5 (IC4.U15), 11_DDR2 (IC7.B3)
DDR2_1_DQ0: 07_FPGA_banks_3_4_5 (IC4.AB10), 11_DDR2 (IC7.G8)
DDR2_1_DQ1: 07_FPGA_banks_3_4_5 (IC4.AB14), 11_DDR2 (IC7.G2)
DDR2_1_DQ2: 07_FPGA_banks_3_4_5 (IC4.AB15), 11_DDR2 (IC7.H7)
DDR2_1_DQ3: 07_FPGA_banks_3_4_5 (IC4.Y13), 11_DDR2 (IC7.H3)
DDR2_1_DQ4: 07_FPGA_banks_3_4_5 (IC4.Y14), 11_DDR2 (IC7.H1)
DDR2_1_DQ5: 07_FPGA_banks_3_4_5 (IC4.W13), 11_DDR2 (IC7.H9)
DDR2_1_DQ6: 07_FPGA_banks_3_4_5 (IC4.W14), 11_DDR2 (IC7.F1)
DDR2_1_DQ7: 07_FPGA_banks_3_4_5 (IC4.W15), 11_DDR2 (IC7.F9)
DDR2_1_DQ8: 07_FPGA_banks_3_4_5 (IC4.AB18), 11_DDR2 (IC7.C8)
DDR2_1_DQ9: 07_FPGA_banks_3_4_5 (IC4.AA16), 11_DDR2 (IC7.C2)
DDR2_1_DQ10: 07_FPGA_banks_3_4_5 (IC4.AA18), 11_DDR2 (IC7.D7)
DDR2_1_DQ11: 07_FPGA_banks_3_4_5 (IC4.Y15), 11_DDR2 (IC7.D3)
DDR2_1_DQ12: 07_FPGA_banks_3_4_5 (IC4.Y16), 11_DDR2 (IC7.D1)
DDR2_1_DQ13: 07_FPGA_banks_3_4_5 (IC4.Y18), 11_DDR2 (IC7.D9)
DDR2_1_DQ14: 07_FPGA_banks_3_4_5 (IC4.Y19), 11_DDR2 (IC7.B1)
DDR2_1_DQ15: 07_FPGA_banks_3_4_5 (IC4.W17), 11_DDR2 (IC7.B9)
DDR2_1_DQS0: 07_FPGA_banks_3_4_5 (IC4.T13), 11_DDR2 (IC7.F7)
DDR2_1_DQS1: 07_FPGA_banks_3_4_5 (IC4.AA15), 11_DDR2 (IC7.B7)
DDR2_1_ODT: 07_FPGA_banks_3_4_5 (IC4.R21), 11_DDR2 (IC7.K9 R64.3)
DDR2_1_RASn: 07_FPGA_banks_3_4_5 (IC4.T21), 11_DDR2 (IC7.K7 R62.4)
DDR2_1_WEn: 07_FPGA_banks_3_4_5 (IC4.V20), 11_DDR2 (IC7.K3 R64.2)
DDR2_2_A0: 07_FPGA_banks_3_4_5 (IC4.M13), 11_DDR2 (IC8.M8 R70.5)
DDR2_2_A1: 07_FPGA_banks_3_4_5 (IC4.P14), 11_DDR2 (IC8.M3 R68.5)
DDR2_2_A2: 07_FPGA_banks_3_4_5 (IC4.M14), 11_DDR2 (IC8.M7 R68.2)
DDR2_2_A3: 07_FPGA_banks_3_4_5 (IC4.T11), 11_DDR2 (IC8.N2 R71.2)
DDR2_2_A4: 07_FPGA_banks_3_4_5 (IC4.N13), 11_DDR2 (IC8.N8 R70.6)
DDR2_2_A5: 07_FPGA_banks_3_4_5 (IC4.N15), 11_DDR2 (IC8.N3 R68.6)
DDR2_2_A6: 07_FPGA_banks_3_4_5 (IC4.M15), 11_DDR2 (IC8.N7 R68.1)
DDR2_2_A7: 07_FPGA_banks_3_4_5 (IC4.M16), 11_DDR2 (IC8.P2 R71.1)
DDR2_2_A8: 07_FPGA_banks_3_4_5 (IC4.P13), 11_DDR2 (IC8.P8 R70.7)
DDR2_2_A9: 07_FPGA_banks_3_4_5 (IC4.P15), 11_DDR2 (IC8.P3 R68.7)
DDR2_2_A10: 07_FPGA_banks_3_4_5 (IC4.R15), 11_DDR2 (IC8.M2 R71.3)
DDR2_2_A11: 07_FPGA_banks_3_4_5 (IC4.N14), 11_DDR2 (IC8.P7 R70.8)
DDR2_2_A12: 07_FPGA_banks_3_4_5 (IC4.N17), 11_DDR2 (IC8.R2 R68.8)
DDR2_2_BA0: 07_FPGA_banks_3_4_5 (IC4.AB13), 11_DDR2 (IC8.L2 R71.4)
DDR2_2_BA1: 07_FPGA_banks_3_4_5 (IC4.AA13), 11_DDR2 (IC8.L3 R71.6)
DDR2_2_BA2: 07_FPGA_banks_3_4_5 (IC4.AA4), 11_DDR2 (IC8.L1 R71.5)
DDR2_2_CASn: 07_FPGA_banks_3_4_5 (IC4.R19), 11_DDR2 (IC8.L7 R68.3)
DDR2_2_CK_N: 07_FPGA_banks_3_4_5 (IC4.Y4), 11_DDR2 (IC8.K8 R69.2)
DDR2_2_CK_P: 07_FPGA_banks_3_4_5 (IC4.W4), 11_DDR2 (IC8.J8 R69.1)
DDR2_2_CKE: 07_FPGA_banks_3_4_5 (IC4.T14), 11_DDR2 (IC8.K2 R71.7)
DDR2_2_CSn: 07_FPGA_banks_3_4_5 (IC4.AB11), 11_DDR2 (IC8.L8 R70.4)
DDR2_2_DM0: 07_FPGA_banks_3_4_5 (IC4.W7), 11_DDR2 (IC8.F3)
DDR2_2_DM1: 07_FPGA_banks_3_4_5 (IC4.W11), 11_DDR2 (IC8.B3)
DDR2_2_DQ0: 07_FPGA_banks_3_4_5 (IC4.AB4), 11_DDR2 (IC8.G8)
DDR2_2_DQ1: 07_FPGA_banks_3_4_5 (IC4.AB5), 11_DDR2 (IC8.G2)
DDR2_2_DQ2: 07_FPGA_banks_3_4_5 (IC4.AA6), 11_DDR2 (IC8.H7)
DDR2_2_DQ3: 07_FPGA_banks_3_4_5 (IC4.Y5), 11_DDR2 (IC8.H3)
DDR2_2_DQ4: 07_FPGA_banks_3_4_5 (IC4.Y6), 11_DDR2 (IC8.H1)
DDR2_2_DQ5: 07_FPGA_banks_3_4_5 (IC4.Y7), 11_DDR2 (IC8.H9)
DDR2_2_DQ6: 07_FPGA_banks_3_4_5 (IC4.W5), 11_DDR2 (IC8.F1)
DDR2_2_DQ7: 07_FPGA_banks_3_4_5 (IC4.W6), 11_DDR2 (IC8.F9)
DDR2_2_DQ8: 07_FPGA_banks_3_4_5 (IC4.AB6), 11_DDR2 (IC8.C8)
DDR2_2_DQ9: 07_FPGA_banks_3_4_5 (IC4.AB8), 11_DDR2 (IC8.C2)
DDR2_2_DQ10: 07_FPGA_banks_3_4_5 (IC4.AA9), 11_DDR2 (IC8.D7)
DDR2_2_DQ11: 07_FPGA_banks_3_4_5 (IC4.AA10), 11_DDR2 (IC8.D3)
DDR2_2_DQ12: 07_FPGA_banks_3_4_5 (IC4.Y9), 11_DDR2 (IC8.D1)
DDR2_2_DQ13: 07_FPGA_banks_3_4_5 (IC4.Y11), 11_DDR2 (IC8.D9)
DDR2_2_DQ14: 07_FPGA_banks_3_4_5 (IC4.Y12), 11_DDR2 (IC8.B1)
DDR2_2_DQ15: 07_FPGA_banks_3_4_5 (IC4.W9), 11_DDR2 (IC8.B9)
DDR2_2_DQS0: 07_FPGA_banks_3_4_5 (IC4.Y8), 11_DDR2 (IC8.F7)
DDR2_2_DQS1: 07_FPGA_banks_3_4_5 (IC4.Y10), 11_DDR2 (IC8.B7)
DDR2_2_ODT: 07_FPGA_banks_3_4_5 (IC4.W18), 11_DDR2 (IC8.K9 R70.3)
DDR2_2_RASn: 07_FPGA_banks_3_4_5 (IC4.U14), 11_DDR2 (IC8.K7 R68.4)
DDR2_2_WEn: 07_FPGA_banks_3_4_5 (IC4.T15), 11_DDR2 (IC8.K3 R70.2)
FAN_CTRL: 08_FPGA_banks_6_7_8 (IC4.K13), 12_Periphs (VT1.G)
FPGA_CLK_OUT: 08_FPGA_banks_6_7_8 (IC4.C18), 13_Clocks_1 (R105.1)
FPGA_GPIO0: 08_FPGA_banks_6_7_8 (IC4.B12), 12_Periphs (J12.3)
FPGA_GPIO1: 08_FPGA_banks_6_7_8 (IC4.C16), 12_Periphs (J12.4)
FPGA_GPIO2: 08_FPGA_banks_6_7_8 (IC4.B15), 12_Periphs (J12.5)
FPGA_GPIO3: 08_FPGA_banks_6_7_8 (IC4.B13), 12_Periphs (J12.6)
FPGA_GPIO4: 08_FPGA_banks_6_7_8 (IC4.A15), 12_Periphs (J12.7)
FPGA_GPIO5: 08_FPGA_banks_6_7_8 (IC4.B16), 12_Periphs (J12.8)
FPGA_GPIO6: 08_FPGA_banks_6_7_8 (IC4.A17), 12_Periphs (J12.9)
FPGA_GPIO7: 08_FPGA_banks_6_7_8 (IC4.A16), 12_Periphs (J12.10)
FPGA_GPIO8: 08_FPGA_banks_6_7_8 (IC4.G15), 12_Periphs (J13.3)
FPGA_GPIO9: 08_FPGA_banks_6_7_8 (IC4.G14), 12_Periphs (J13.4)
FPGA_GPIO10: 08_FPGA_banks_6_7_8 (IC4.D14), 12_Periphs (J13.5)
FPGA_GPIO11: 08_FPGA_banks_6_7_8 (IC4.D15), 12_Periphs (J13.6)
FPGA_GPIO12: 08_FPGA_banks_6_7_8 (IC4.C14), 12_Periphs (J13.7)
FPGA_GPIO13: 08_FPGA_banks_6_7_8 (IC4.C15), 12_Periphs (J13.8)
FPGA_GPIO14: 08_FPGA_banks_6_7_8 (IC4.C12), 12_Periphs (J13.9)
FPGA_GPIO15: 08_FPGA_banks_6_7_8 (IC4.C13), 12_Periphs (J13.10)
FPGA_I2C_SCL: 08_FPGA_banks_6_7_8 (IC4.G17), 12_Periphs (IC10.2 R94.2), 13_Clocks_1 (IC15.4)
FPGA_I2C_SDA: 08_FPGA_banks_6_7_8 (IC4.G16), 12_Periphs (IC10.1 R93.2), 13_Clocks_1 (IC15.5)
FPGA_LED1_G: 08_FPGA_banks_6_7_8 (IC4.H21), 12_Periphs (R75.1)
FPGA_LED1_R: 08_FPGA_banks_6_7_8 (IC4.E20), 12_Periphs (LED1.2 LED1.3 LEDS1.K1)
FPGA_LED2_G: 08_FPGA_banks_6_7_8 (IC4.G20), 12_Periphs (R80.1)
FPGA_LED2_R: 08_FPGA_banks_6_7_8 (IC4.G21), 12_Periphs (LED4.2 LED4.3 LEDS1.K2)
FPGA_LED3: 08_FPGA_banks_6_7_8 (IC4.K20), 12_Periphs (R84.1)
FPGA_LED4: 08_FPGA_banks_6_7_8 (IC4.K19), 12_Periphs (R85.1)
FPGA_LED5: 08_FPGA_banks_6_7_8 (IC4.K22), 12_Periphs (R86.1)
FPGA_LED6: 08_FPGA_banks_6_7_8 (IC4.H20), 12_Periphs (R87.1)
FPGA_SPI0_LMS_SS: 04_LMS7002M_Digital (R10.2), 08_FPGA_banks_6_7_8 (IC4.D19)
FPGA_SPI0_MISO: 04_LMS7002M_Digital (R13.2), 08_FPGA_banks_6_7_8 (IC4.B20)
FPGA_SPI0_MOSI: 04_LMS7002M_Digital (R12.2), 08_FPGA_banks_6_7_8 (IC4.B21)
FPGA_SPI0_SCLK: 04_LMS7002M_Digital (R11.2), 08_FPGA_banks_6_7_8 (IC4.D20)
FPGA_SPI1_ADF_SS: 08_FPGA_banks_6_7_8 (IC4.B19), 13_Clocks_1 (R121.1)
FPGA_SPI1_DAC_SS: 08_FPGA_banks_6_7_8 (IC4.A20), 13_Clocks_1 (IC13.1)
FPGA_SPI1_MOSI: 08_FPGA_banks_6_7_8 (IC4.C19), 13_Clocks_1 (IC13.3 R120.1)
FPGA_SPI1_SCLK: 08_FPGA_banks_6_7_8 (IC4.C20), 13_Clocks_1 (IC13.2 R119.1)
FPGA_SPI2_FLASH_SS: 08_FPGA_banks_6_7_8 (IC4.J22), 12_Periphs (IC9.1 R81.2)
FPGA_SPI2_MISO: 08_FPGA_banks_6_7_8 (IC4.J21), 12_Periphs (IC9.2)
FPGA_SPI2_MOSI: 08_FPGA_banks_6_7_8 (IC4.H22), 12_Periphs (IC9.5)
FPGA_SPI2_SCLK: 08_FPGA_banks_6_7_8 (IC4.J19), 12_Periphs (IC9.6 R74.2)
FPGA_SW0: 08_FPGA_banks_6_7_8 (IC4.D22), 12_Periphs (R79.2 SW1.8)
FPGA_SW1: 08_FPGA_banks_6_7_8 (IC4.E21), 12_Periphs (R78.2 SW1.7)
FPGA_SW2: 08_FPGA_banks_6_7_8 (IC4.E22), 12_Periphs (R77.2 SW1.6)
FPGA_SW3: 08_FPGA_banks_6_7_8 (IC4.G22), 12_Periphs (R76.2 SW1.5)
LM75_OS: 08_FPGA_banks_6_7_8 (IC4.K14), 12_Periphs (IC10.3 R95.2)
LMS_CORE_LDO_EN: 04_LMS7002M_Digital (IC1.U33 R8.1), 08_FPGA_banks_6_7_8 (IC4.C4)
LMS_DIQ1_D0: 04_LMS7002M_Digital (IC1.AG31), 08_FPGA_banks_6_7_8 (IC4.D9)
LMS_DIQ1_D1: 04_LMS7002M_Digital (IC1.AF30), 08_FPGA_banks_6_7_8 (IC4.B7)
LMS_DIQ1_D2: 04_LMS7002M_Digital (IC1.AF34), 08_FPGA_banks_6_7_8 (IC4.H8)
LMS_DIQ1_D3: 04_LMS7002M_Digital (IC1.AE31), 08_FPGA_banks_6_7_8 (IC4.C8)
LMS_DIQ1_D4: 04_LMS7002M_Digital (IC1.AD30), 08_FPGA_banks_6_7_8 (IC4.C7)
LMS_DIQ1_D5: 04_LMS7002M_Digital (IC1.AC29), 08_FPGA_banks_6_7_8 (IC4.C9)
LMS_DIQ1_D6: 04_LMS7002M_Digital (IC1.AE33), 08_FPGA_banks_6_7_8 (IC4.H7)
LMS_DIQ1_D7: 04_LMS7002M_Digital (IC1.AD32), 08_FPGA_banks_6_7_8 (IC4.G8)
LMS_DIQ1_D8: 04_LMS7002M_Digital (IC1.AC31), 08_FPGA_banks_6_7_8 (IC4.E8)
LMS_DIQ1_D9: 04_LMS7002M_Digital (IC1.AC33), 08_FPGA_banks_6_7_8 (IC4.G7)
LMS_DIQ1_D10: 04_LMS7002M_Digital (IC1.AB30), 08_FPGA_banks_6_7_8 (IC4.F8)
LMS_DIQ1_D11: 04_LMS7002M_Digital (IC1.AB32), 08_FPGA_banks_6_7_8 (IC4.E6)
LMS_DIQ2_D0: 04_LMS7002M_Digital (IC1.H30), 08_FPGA_banks_6_7_8 (IC4.G6)
LMS_DIQ2_D1: 04_LMS7002M_Digital (IC1.J31), 08_FPGA_banks_6_7_8 (IC4.E5)
LMS_DIQ2_D2: 04_LMS7002M_Digital (IC1.K30), 08_FPGA_banks_6_7_8 (IC4.A8)
LMS_DIQ2_D3: 04_LMS7002M_Digital (IC1.K32), 08_FPGA_banks_6_7_8 (IC4.D7)
LMS_DIQ2_D4: 04_LMS7002M_Digital (IC1.L31), 08_FPGA_banks_6_7_8 (IC4.D8)
LMS_DIQ2_D5: 04_LMS7002M_Digital (IC1.K34), 08_FPGA_banks_6_7_8 (IC4.F6)
LMS_DIQ2_D6: 04_LMS7002M_Digital (IC1.M30), 08_FPGA_banks_6_7_8 (IC4.C6)
LMS_DIQ2_D7: 04_LMS7002M_Digital (IC1.M32), 08_FPGA_banks_6_7_8 (IC4.D4)
LMS_DIQ2_D8: 04_LMS7002M_Digital (IC1.N31), 08_FPGA_banks_6_7_8 (IC4.A5)
LMS_DIQ2_D9: 04_LMS7002M_Digital (IC1.N33), 08_FPGA_banks_6_7_8 (IC4.D5)
LMS_DIQ2_D10: 04_LMS7002M_Digital (IC1.P30), 08_FPGA_banks_6_7_8 (IC4.B4)
LMS_DIQ2_D11: 04_LMS7002M_Digital (IC1.P32), 08_FPGA_banks_6_7_8 (IC4.A6)
LMS_ENABLE_IQSEL1: 04_LMS7002M_Digital (IC1.Y32), 08_FPGA_banks_6_7_8 (IC4.D6)
LMS_ENABLE_IQSEL2: 04_LMS7002M_Digital (IC1.R33), 08_FPGA_banks_6_7_8 (IC4.B6)
LMS_FCLK1: 04_LMS7002M_Digital (IC1.AA33), 08_FPGA_banks_6_7_8 (IC4.H9)
LMS_FCLK2: 04_LMS7002M_Digital (IC1.R29), 08_FPGA_banks_6_7_8 (IC4.C5)
LMS_MCLK1: 04_LMS7002M_Digital (IC1.AB34), 08_FPGA_banks_6_7_8 (IC4.K10)
LMS_MCLK2: 04_LMS7002M_Digital (IC1.P34), 07_FPGA_banks_3_4_5 (IC4.M8)
LMS_RESET: 04_LMS7002M_Digital (IC1.E27 R7.1), 08_FPGA_banks_6_7_8 (IC4.A1)
LMS_RXEN: 04_LMS7002M_Digital (IC1.V34 R3.2), 08_FPGA_banks_6_7_8 (IC4.C2)
LMS_TXEN: 04_LMS7002M_Digital (IC1.U29 R6.2), 08_FPGA_banks_6_7_8 (IC4.A7)
LMS_TXNRX1: 04_LMS7002M_Digital (IC1.V32 R5.2), 08_FPGA_banks_6_7_8 (IC4.C3)
LMS_TXNRX2: 04_LMS7002M_Digital (IC1.U31 R2.2), 08_FPGA_banks_6_7_8 (IC4.A4)
PCIE_HSI0_N: 09_FPGA_misc (C98.2), 12_Periphs (P1.A17)
PCIE_HSI0_P: 09_FPGA_misc (C97.2), 12_Periphs (P1.A16)
PCIE_HSI1_N: 09_FPGA_misc (C96.2), 12_Periphs (P1.A22)
PCIE_HSI1_P: 09_FPGA_misc (C95.2), 12_Periphs (P1.A21)
PCIE_HSI2_N: 09_FPGA_misc (C94.2), 12_Periphs (P1.A26)
PCIE_HSI2_P: 09_FPGA_misc (C93.2), 12_Periphs (P1.A25)
PCIE_HSI3_N: 09_FPGA_misc (C92.2), 12_Periphs (P1.A30)
PCIE_HSI3_P: 09_FPGA_misc (C90.2), 12_Periphs (P1.A29)
PCIE_HSO0_N: 09_FPGA_misc (IC4.Y1), 12_Periphs (P1.B15)
PCIE_HSO0_P: 09_FPGA_misc (IC4.Y2), 12_Periphs (P1.B14)
PCIE_HSO1_N: 09_FPGA_misc (IC4.T1), 12_Periphs (P1.B20)
PCIE_HSO1_P: 09_FPGA_misc (IC4.T2), 12_Periphs (P1.B19)
PCIE_HSO2_N: 09_FPGA_misc (IC4.M1), 12_Periphs (P1.B24)
PCIE_HSO2_P: 09_FPGA_misc (IC4.M2), 12_Periphs (P1.B23)
PCIE_HSO3_N: 09_FPGA_misc (IC4.H1), 12_Periphs (P1.B28)
PCIE_HSO3_P: 09_FPGA_misc (IC4.H2), 12_Periphs (P1.B27)
PCIE_PERSTn: 08_FPGA_banks_6_7_8 (IC4.H12), 12_Periphs (P1.A11)
PCIE_REFCLK_N: 07_FPGA_banks_3_4_5 (IC4.N11), 12_Periphs (P1.A14)
PCIE_REFCLK_P: 07_FPGA_banks_3_4_5 (IC4.M11), 12_Periphs (P1.A13)
PCIE_SMCLK: 08_FPGA_banks_6_7_8 (IC4.A10), 12_Periphs (P1.B5)
PCIE_SMDAT: 08_FPGA_banks_6_7_8 (IC4.B10), 12_Periphs (P1.B6)
PCIE_WAKEn: 08_FPGA_banks_6_7_8 (IC4.G12), 12_Periphs (R90.1)
RxPLL_CLK: 04_LMS7002M_Digital (R1.2), 13_Clocks_1 (C295.2 R101.1)
SI_CLK0: 07_FPGA_banks_3_4_5 (IC4.M7), 13_Clocks_1 (IC15.13)
SI_CLK1: 07_FPGA_banks_3_4_5 (IC4.N7), 13_Clocks_1 (IC15.12)
SI_CLK2: 07_FPGA_banks_3_4_5 (IC4.N8), 13_Clocks_1 (IC15.9)
SI_CLK3: 08_FPGA_banks_6_7_8 (IC4.J10), 13_Clocks_1 (IC15.8)
SI_CLK6: 08_FPGA_banks_6_7_8 (IC4.L22), 13_Clocks_1 (IC15.16)
TxPLL_CLK: 04_LMS7002M_Digital (R4.2), 13_Clocks_1 (C294.2 R98.1)